# Altium project TIDA-01592-E1.PrjPcb (part 3 of 4)

## Sheet TIDA-01592_Power Supply2.SchDoc: Power Supply
size 431 x 279 mm; Date: Not shown in title block; ApprovedBy: Not shown in title block; CheckedBy: Not shown in title block; Author: Not shown in title block; CompanyName: Not shown in title block; DrawnBy: Abhishek Vishwa; Engineer: Abhishek Vishwa; Organization: Not shown in title block; Address1: Not shown in title block; Address2: Not shown in title block; Address3: Not shown in title block; Address4: Not shown in title block; DocumentNumber: 1; Revision: Use project parameter SCH_Rev; SheetNumber: 3; SheetTotal: 5; PageSetup: Record=PageOptions|CenterHorizontal=True|CenterVertical=True|PrintScale=1.00|XCorrection=1.00|YCorrection=1.00|PrintKind=0|BorderSize=5000000|LeftOffset=0|BottomOffset=0|Orientation=2|PaperLength=1000|PaperWidth=1000|Scale=100|PaperSource=15|PrintQuality=600|MediaType=1|DitherType=10|PaperKind=Letter|PrintScaleMode=1; CurrentTime: Not shown in title block; CurrentDate: Not shown in title block; Time: Not shown in title block; DocumentFullPathAndName: Not shown in title block; DocumentName: Not shown in title block; ModifiedDate: Not shown in title block; ImagePath: Not shown in title block; ProjectName: HV PS for Transmitter
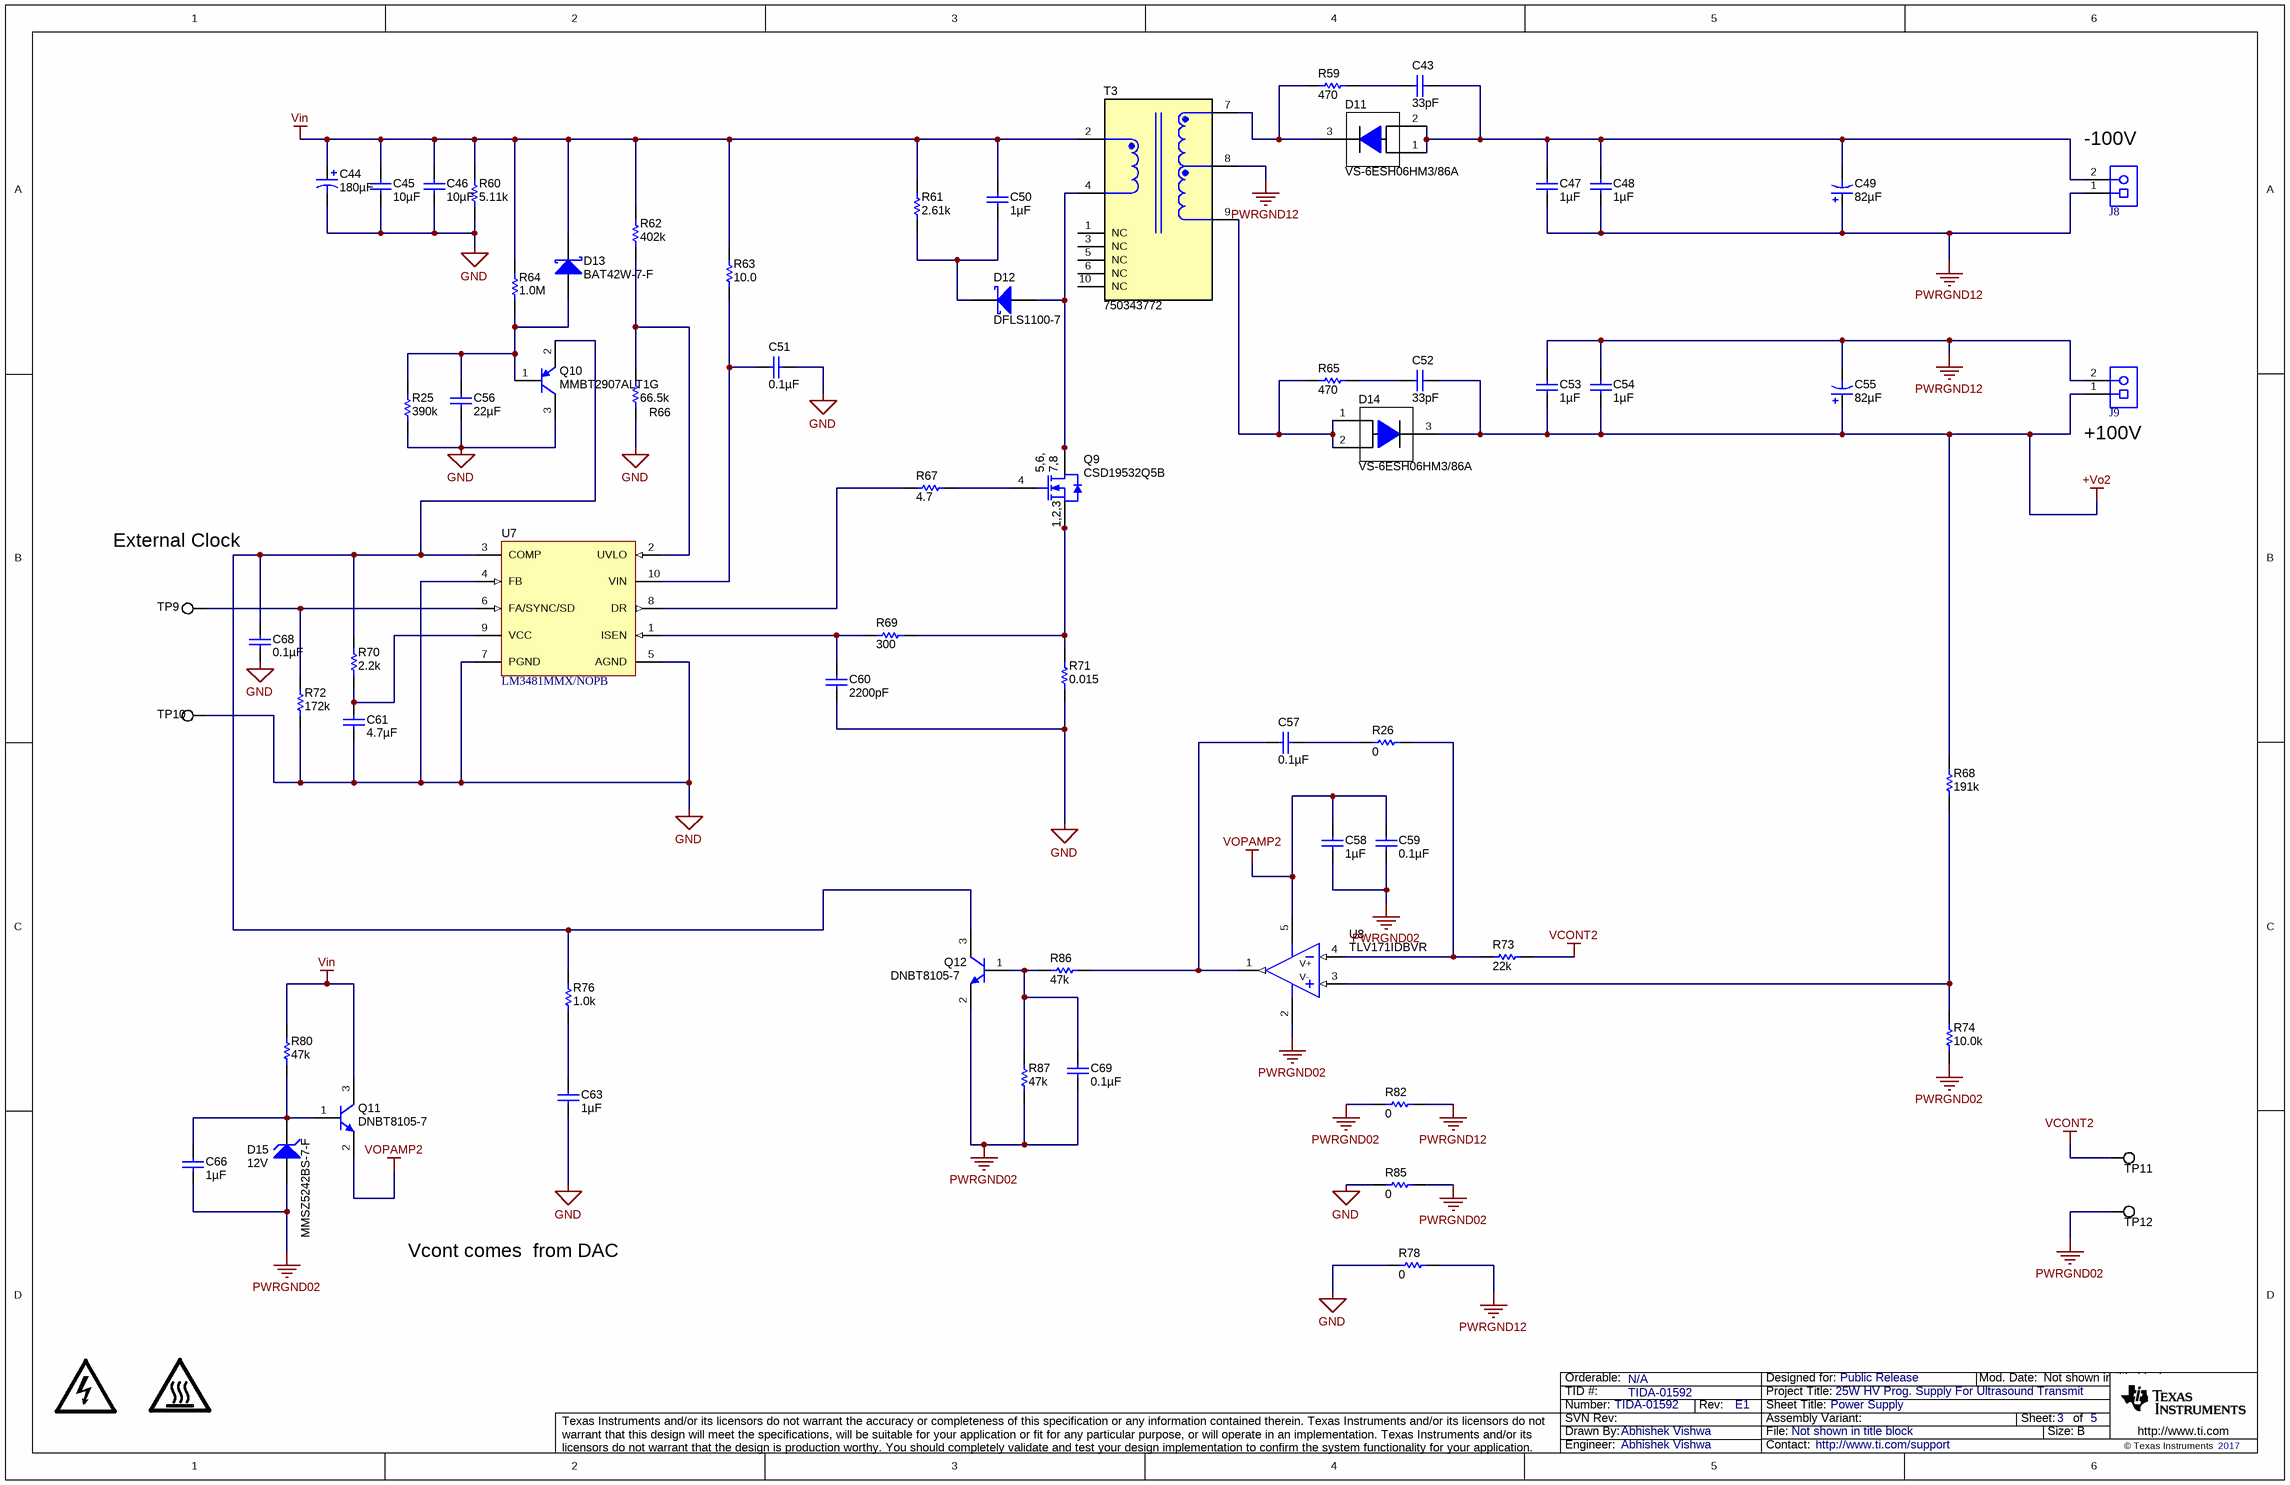
[diagram p2: TIDA-01592_Power Supply2.SchDoc]

### Parts
(Parts that share a designator on the sheet are numbered #1, #2 ... from top to bottom, then left to right.)
C43  ValueDisplayed: 33pF  [1206]  (hidden comment: 12067A330JAT2A)
C44  ValueDisplayed: 180µF  [FC_630x1120]  (hidden comment: 35TXW180MEFC6.3X25)
C45  ValueDisplayed: 10µF  [1206_180]  (hidden comment: GRM31CR61H106KA12L)
C46  ValueDisplayed: 10µF  [1206_180]  (hidden comment: GRM31CR61H106KA12L)
C47  ValueDisplayed: 1µF  [1812_180]  (hidden comment: C4532X7T2E105M250KE)
C48  ValueDisplayed: 1µF  [1812_180]  (hidden comment: C4532X7T2E105M250KE)
C49  ValueDisplayed: 82µF  [NHG_1000x2000]  (hidden comment: UCY2C820MPD9)
C50  ValueDisplayed: 1µF  [1206_180]  (hidden comment: GRM31CR72A105KA01L)
C51  ValueDisplayed: 0.1µF  [0603]  (hidden comment: GRM188R71H104KA93D)
C52  ValueDisplayed: 33pF  [1206]  (hidden comment: 12067A330JAT2A)
C53  ValueDisplayed: 1µF  [1812_180]  (hidden comment: C4532X7T2E105M250KE)
C54  ValueDisplayed: 1µF  [1812_180]  (hidden comment: C4532X7T2E105M250KE)
C55  ValueDisplayed: 82µF  [NHG_1000x2000]  (hidden comment: UCY2C820MPD9)
C56  ValueDisplayed: 22µF  [0805_HV1]  (hidden comment: C2012X5R1V226M125AC)
C57  ValueDisplayed: 0.1µF  [0603]  (hidden comment: GRM188R71H104KA93D)
C58  ValueDisplayed: 1µF  [0603]  (hidden comment: UMK107AB7105KA-T)
C59  ValueDisplayed: 0.1µF  [0603]  (hidden comment: GRM188R71H104KA93D)
C60  ValueDisplayed: 2200pF  [0402]  (hidden comment: GRM155R61H222KA01D)
C61  ValueDisplayed: 4.7µF  [0603]  (hidden comment: 0603ZD475KAT2A)
C63  ValueDisplayed: 1µF  [0603]  (hidden comment: C0603C105K3RACTU)
C66  ValueDisplayed: 1µF  [0603]  (hidden comment: C0603C105K3RACTU)
C68  ValueDisplayed: 0.1µF  [0603]  (hidden comment: GRM188R71H104KA93D)
C69  ValueDisplayed: 0.1µF  [0603]  (hidden comment: GRM188R71H104KA93D)
D11  VS-6ESH06HM3/86A  [TO-277A]
D12  DFLS1100-7  [PowerDI123]
D13  BAT42W-7-F  [SOD-123]
D14  VS-6ESH06HM3/86A  [TO-277A]
D15  MMSZ5242BS-7-F  value 12V  [SOD-323]
J8  1727010  [PhoenixConact_1727010]  (value not drawn)
J9  1727010  [PhoenixConact_1727010]  (value not drawn)
LOGO2#3  CAUTION HOT SURFACE  [IEC_HotSurface_Small]  (value not drawn)  (graphical)
LOGO8#3  DANGER HIGH VOLTAGE  [IEC_HighVoltage_Small]  (value not drawn)  (graphical)
Q9  CSD19532Q5B  [DNK0008A]
Q10  MMBT2907ALT1G  [SOT-23]
Q11  DNBT8105-7  [SOT-23]
Q12  DNBT8105-7  [SOT-23]
R25  ValueDisplayed: 390k  [0603]  (hidden comment: CRCW0603390KJNEA)
R26  ValueDisplayed: 0  [0402]  (hidden comment: CRCW04020000Z0ED)
R59  ValueDisplayed: 470  [1206]  (hidden comment: CRCW1206470RJNEA)
R60  ValueDisplayed: 5.11k  [TNPW0603]  (hidden comment: TNPW06035K11BEEA)
R61  ValueDisplayed: 2.61k  [2010]  (hidden comment: CRCW20102K61FKEF)
R62  ValueDisplayed: 402k  [0603]  (hidden comment: CRCW0603402KFKEA)
R63  R4: 10.0  [0603]  (hidden comment: CRCW060310R0FKEAHP)
R64  ValueDisplayed: 1.0M  [0603]  (hidden comment: CRCW06031M00JNEA)
R65  ValueDisplayed: 470  [1206]  (hidden comment: CRCW1206470RJNEA)
R66  ValueDisplayed: 66.5k  [0603]  (hidden comment: CRCW060366K5FKEA)
R67  ValueDisplayed: 4.7  [0603]  (hidden comment: CRCW06034R70JNEA)
R68  ValueDisplayed: 191k  [0603]  (hidden comment: CRCW0603191KFKEA)
R69  ValueDisplayed: 300  [0603]  (hidden comment: CRCW0603300RJNEA)
R70  ValueDisplayed: 2.2k  [0603]  (hidden comment: ERJ-3GEYJ222V)
R71  ValueDisplayed: 0.015  [2010]  (hidden comment: WSL2010R0150FEA18)
R72  ValueDisplayed: 172k  [0603]  (hidden comment: RT0603DRE07172KL)
R73  ValueDisplayed: 22k  [0603]  (hidden comment: CRCW060322K0JNEA)
R74  ValueDisplayed: 10.0k  [0603]  (hidden comment: CRCW060310K0FKEA)
R76  ValueDisplayed: 1.0k  [0603]  (hidden comment: CRCW06031K00JNEA)
R78  ValueDisplayed: 0  [2010L]  (hidden comment: CRCW20100000Z0EF)
R80  ValueDisplayed: 47k  [1206]  (hidden comment: CRCW120647K0JNEA)
R82  ValueDisplayed: 0  [2010L]  (hidden comment: CRCW20100000Z0EF)
R85  ValueDisplayed: 0  [2010L]  (hidden comment: CRCW20100000Z0EF)
R86  ValueDisplayed: 47k  [0603]  (hidden comment: RC0603JR-0747KL)
R87  ValueDisplayed: 47k  [0603]  (hidden comment: RC0603JR-0747KL)
T3  750343772  [Wurth_EE16_7_5_5278]
TP9  5002  [Keystone5002]  (value not drawn)
TP10  5002  [Keystone5002]  (value not drawn)
TP11  5002  [Keystone5002]  (value not drawn)
TP12  5002  [Keystone5002]  (value not drawn)
U7  LM3481MMX/NOPB  [MUB10A_N]
U8  TLV171IDBVR  [DBV0005A_N]

### Nets
+Vo2: C52.1 C53.2 C54.2 C55.1(+) D14.3(K) J9.1 R68.2
GND: C44.2(-) C45.2 C46.2 C51.1 C56.2 C60.2 C61.2 C63.2 C68.1 Q10.3(C) R25.1 R60.1 R66.1 R71.1 R72.1 R78.1 R85.1 TP10.1 U7.4(FB) U7.5(AGND) U7.7(PGND)
PWRGND02: C58.2 C59.2 C66.2 C69.1 D15.2(A) Q12.2(E) R74.2 R82.1 R85.2 R87.2 TP12.1 U8.2(V-)
PWRGND12: C47.2 C48.2 C49.1(+) C53.1 C54.1 C55.2(-) J8.1 J9.2 R78.2 R82.2 T3.8
VCONT2: R73.2 TP11.1
Vin: C44.1(+) C45.1 C46.1 C50.1 D13.1(K) Q11.3(C) R60.2 R61.2 R62.2 R63.1 R64.2 R80.2 T3.2
VOPAMP2: C58.1 C59.1 Q11.2(E) U8.5(V+)
NetC43_1: C43.1 C47.1 C48.1 C49.2(-) D11.1(A) D11.2(A) J8.2
NetC43_2: C43.2 R59.2
NetC50_2: C50.2 D12.1(K) R61.1
NetC51_2: C51.2 R63.2 U7.10(VIN)
NetC52_2: C52.2 R65.2
NetC56_1: C56.1 D13.2(A) Q10.1(B) R25.2 R64.1
NetC57_1: C57.1 R86.1 U8.1(OUT)
NetC57_2: C57.2 R26.1
NetC60_1: C60.1 R69.1 U7.1(ISEN)
NetC61_1: C61.1 R70.2 U7.9(VCC)
NetC63_1: C63.1 R76.1
NetC66_1: C66.1 D15.1(K) Q11.1(B) R80.1
NetC68_2: C68.2 Q10.2(E) Q12.3(C) R70.1 R76.2 U7.3(COMP)
NetC69_2: C69.2 Q12.1(B) R86.2 R87.1
NetD11_3: D11.3(K) R59.1 T3.7
NetD12_2: D12.2(A) Q9.5(D) Q9.6(D) Q9.7(D) Q9.8(D) Q9.9(D) T3.4
NetD14_1: D14.1(A) D14.2(A) R65.1 T3.9
NetQ9_1: Q9.1(S) Q9.2(S) Q9.3(S) R69.2 R71.2
NetQ9_4: Q9.4(G) R67.2
NetR26_2: R26.2 R73.1 U8.4(IN-)
NetR62_1: R62.1 R66.2 U7.2(UVLO)
NetR67_1: R67.1 U7.8(DR)
NetR68_1: R68.1 R74.1 U8.3(IN+)
NetR72_2: R72.2 TP9.1 U7.6(FA/SYNC/SD)

Not connected (* = marked no-connect by the designer): T3 1(NC) 3(NC) 5(NC) 6(NC) 10(NC)

### Notes on the sheet
- (near J8) -100V
- (near J9) +100V
- External Clock Synchronization
- Vcont comes  from DAC
- Drawn By:
- SVN Rev:
- Number:
- TID #:
- Orderable:
- Rev:
- Sheet Title:
- File:
- Project Title:
- Designed for:
- Assembly Variant:
- Mod. Date:
- Sheet:
- Size:
- of
- B
- http://www.ti.com
- Texas Instruments and/or its licensors do not warrant the accuracy or completeness of this specification or any information contained therein. Texas Instruments and/or its licensors do not warrant that this design will meet the specifications, will be suitable for your application or fit for any particular purpose, or will operate in an implementation. Texas Instruments and/or its licensors do not warrant that the design is production worthy. You should completely validate and test your design implementation to confirm the system functionality for your application.
- Engineer:
- Contact:
- © Texas Instruments
- (in symbol CSD19532Q5B) 5,6,; 7,8; 1,2,3

### Library data of the parts
C43 C52 = 12067A330JAT2A: CAP, CERM, 33 pF, 500 V,+/- 5%, C0G/NP0, 1206; Manufacturer: AVX; Polarized: N; CompType: Capacitor; Value: 33pF; U/M: EA; Cap_F: 0.000000000033; Tolerance_%: 5; VDC_V: 500; Value2: 500V; TaMin_C: -55; TaMax_C: 125; SizeArea_mm2: 5.12; SizeAreaWB_mm2: 10.92; SizeX_mm: 3.2; SizeY_mm: 1.6; SizeZ_mm: 1.35; AEC Category: Q200; Green_Lifecycle: Not Set; Green_REACh: Incomplete; SymbolVersion: 2008-07-09; PartNumber: 12067A330JAT2A; PackageReference: 1206; RoHS: Y; MountType: SMT; Technology: Ceramic; TempCo: C0G/NP0; Cap_Case: 1206; Published: 2008-06-19; Publisher: Texas Instruments; LatestRevisionDate: 2017-06-22; ComponentLink1Description: Datasheet link; ComponentLink1URL: http://partbuilder.avx.com/p/pb/pdf/1027/C0GNP0-Dielectric.pdf; Supplier 1: Digi-Key; Supplier Part Number 1: 12067A330JAT2A-ND; Supplier 2: Newark; Supplier Part Number 2: 55J9805; Supplier 3: Mouser; Supplier Part Number 3: 581-12067A330JAT2A; AEC Qualified: N; AEC Grade: N/A; Green_EU RoHS: Incomplete; Green_EU RoHS-2: Incomplete
C44 = EEU-FC1V470: CAP, AL, 180 µF, 35 V, +/- 20%, TH; Manufacturer: Rubycon; Polarized: Y; CompType: Capacitor; Value: 180uF; U/M: EA; Cap_F: 0.000180; Tolerance_%: 20; VDC_V: 35; Value2: 35V; IRMS_A: 0.29; TaMin_C: -55; TaMax_C: 105; Cap_Case: 6.3x11.2mm; SizeAreaWB_mm2: 68.89; SizeArea_mm2: 39.69; SizeX_mm: 6.3; SizeZ_mm: 12.2; AEC Category: Q200; AEC Grade: 2; SymbolVersion: 2008-07-09; PartNumber: 35TXW180MEFC6.3X25; RoHS: Y; MountType: TH; Technology: AL; Series: FC; SizeY_mm: 6.3; Publisher: Texas Instruments; LatestRevisionDate: 2017-06-22; Supplier 1: Digi-Key; Supplier Part Number 1: 35TXW180MEFC6.3X25-ND; AEC Qualified: Y
C45 C46 = GRM31CR61H106KA12L: CAP, CERM, 10 µF, 50 V,+/- 10%, X5R, 1206; Manufacturer: MuRata; Polarized: N; CompType: Capacitor; Value: 10uF; U/M: EA; Cap_F: 0.00001; Tolerance_%: 10; VDC_V: 50; Value2: 50V; TaMin_C: -55; TaMax_C: 85; Cap_Case: 1206; SizeArea_mm2: 5.12; SizeAreaWB_mm2: 10.92; SizeX_mm: 3.2; SizeY_mm: 1.6; SizeZ_mm: 1.8; AEC Category: Q200; Green_Lifecycle: Active; Green_REACh: Passed; SymbolVersion: 2008-07-09; PartNumber: GRM31CR61H106KA12L; PackageReference: 1206; RoHS: Y; MountType: SMT; Technology: Ceramic; TempCo: X5R; Published: 2008-06-19; Publisher: Texas Instruments; LatestRevisionDate: 2017-06-22; ComponentLink1Description: Datasheet link; ComponentLink1URL: http://search.murata.co.jp/Ceramy/image/img/A01X/G101/ENG/GRM31CR61H106KA12-01.pdf; Supplier 1: Digi-Key; Supplier Part Number 1: 490-5961-1-ND; Supplier 2: Newark; Supplier Part Number 2: 13T1214; Supplier 3: Mouser; Supplier Part Number 3: 81-GRM31CR61H106KA2L; AEC Qualified: N; AEC Grade: N/A; Green_EU RoHS: Passed; Green_EU RoHS-2: Incomplete
C47 C48 C53 C54 = C4532X7R1H105K160KA: CAP, CERM, 1 µF, 250 V,+/- 20%, X7T, 1812; Manufacturer: TDK Corporation; Polarized: N; CompType: Capacitor; Value: 1uF; U/M: EA; Cap_F: 0.000001; Tolerance_%: 20; ESR_ohm: 0.007217; Value1: 0.007217 ohm; VDC_V: 50; Value2: 250V; IRMS_A: 2.85919; TaMin_C: -55; TaMax_C: 125; Cap_Case: 1812; SizeArea_mm2: 14.4; SizeAreaWB_mm2: 23.1; SizeX_mm: 4.5; SizeY_mm: 3.2; SizeZ_mm: 1.8; AEC Category: Q200; SymbolVersion: 2008-07-09; PartNumber: C4532X7T2E105M250KE; PackageReference: 1812; RoHS: Y; MountType: SMT; Technology: Ceramic; TempCo: X7T; Published: 2008-06-19; Publisher: Texas Instruments; LatestRevisionDate: 2017-06-22; ComponentLink1Description: Datasheet link; ComponentLink1URL: https://product.tdk.com/en/search/capacitor/ceramic/mlcc/info?part_no=C4532X7R1H105K160KA; Supplier 1: Digi-Key; Supplier Part Number 1: 445-6835-2-ND; Supplier 2: Mouser; Supplier Part Number 2: C4532X7T2E105M250KE; AEC Qualified: N; AEC Grade: N/A
C49 C55 = ECA-2AHG101: CAP, AL, 82 µF, 160 V, +/- 20%, TH; Manufacturer: Nichicon; Polarized: Y; CompType: Capacitor; Value: 82uF; U/M: EA; Cap_F: 0.0001; Tolerance_%: 20; VDC_V: 160; Value2: 160V; IRMS_A: 0.265; TaMin_C: -55; TaMax_C: 105; Cap_Case: 10x20mm; SizeAreaWB_mm2: 144; SizeArea_mm2: 100; SizeX_mm: 10; SizeZ_mm: 22; AEC Category: Q200; Green_Lifecycle: Active; Green_REACh: Passed; SymbolVersion: 2008-07-09; PartNumber: UCY2C820MPD9; PackageReference: 10x20mm; RoHS: Y; MountType: TH; Technology: AL; Series: NHG; SizeY_mm: 10; Publisher: Texas Instruments; LatestRevisionDate: 2017-06-22; Supplier 1: Digi-Key; Supplier Part Number 1: 493-6989-ND; AEC Qualified: ?; Green_EU RoHS: Passed; Green_EU RoHS-2: Passed
C50 = GRM31CR72A105KA01L: CAP, CERM, 1 µF, 100 V,+/- 10%, X7R, 1206; Manufacturer: MuRata; Polarized: N; CompType: Capacitor; Value: 1uF; U/M: EA; Cap_F: 0.000001; Tolerance_%: 10; VDC_V: 100; Value2: 100V; TaMin_C: -55; TaMax_C: 125; Cap_Case: 1206; SizeArea_mm2: 5.12; SizeAreaWB_mm2: 10.92; SizeX_mm: 3.2; SizeY_mm: 1.6; SizeZ_mm: 1.8; AEC Category: Q200; Green_Lifecycle: Active; Green_REACh: Passed; SymbolVersion: 2008-07-09; PartNumber: GRM31CR72A105KA01L; PackageReference: 1206; RoHS: Y; MountType: SMT; Technology: Ceramic; TempCo: X7R; Published: 2008-06-19; Publisher: Texas Instruments; LatestRevisionDate: 2017-06-22; ComponentLink1Description: Datasheet link; ComponentLink1URL: http://search.murata.co.jp/Ceramy/PnsearchViewAction.do?HnOFG=ON&HnNFG=ON&SEL_CNT=50&sLang=en&sKey=GRM31CR72A105KA01L&x=9&y=9&search=startwith; Supplier 1: Digi-Key; Supplier Part Number 1: 490-3909-1-ND; Supplier 2: Mouser; Supplier Part Number 2: 81-GRM31CR72A105KA01; Supplier 3: Farnell; Supplier Part Number 3: 1735543; AEC Qualified: ?; Green_EU RoHS: Passed; Green_EU RoHS-2: Incomplete
C51 C57 C59 C68 C69 = GRM188R71H104KA93D: CAP, CERM, 0.1 µF, 50 V,+/- 10%, X7R, 0603; Manufacturer: MuRata; Polarized: N; CompType: Capacitor; Value: 0.1uF; U/M: EA; Cap_F: 0.0000001; Tolerance_%: 10; VDC_V: 50; Value2: 50V; TaMin_C: -55; TaMax_C: 125; SizeArea_mm2: 1.28; SizeAreaWB_mm2: 4.68; SizeX_mm: 1.6; SizeY_mm: 0.8; SizeZ_mm: 1; AEC Category: Q200; Green_Lifecycle: Active; Green_REACh: Passed; SymbolVersion: 2008-07-09; PartNumber: GRM188R71H104KA93D; PackageReference: 0603; RoHS: Y; MountType: SMT; Technology: Ceramic; TempCo: X7R; Cap_Case: 0603; Published: 2008-06-19; Publisher: Texas Instruments; LatestRevisionDate: 2017-06-22; ComponentLink1Description: Datasheet link; ComponentLink1URL: http://search.murata.co.jp/Ceramy/PnsearchViewAction.do?HnOFG=ON&HnNFG=ON&SEL_CNT=50&sLang=en&sKey=GRM188R71H104KA93D&x=9&y=9&search=startwith; Supplier 1: Digi-Key; Supplier Part Number 1: 490-1519-1-ND; Supplier 2: Mouser; Supplier Part Number 2: 81-GRM39X104K50D; Supplier 3: Farnell; Supplier Part Number 3: 8820023; AEC Qualified: ?; Green_EU RoHS: Passed; Green_EU RoHS-2: Incomplete
C56 = GRM21BC81C226ME44L: CAP, CERM, 22 µF, 35 V,+/- 20%, X5R, 0805; Manufacturer: TDK Corporation; Polarized: N; CompType: Capacitor; Value: 22uF; U/M: EA; Cap_F: 0.000022; Tolerance_%: 20; VDC_V: 16; Value2: 35V; TempCo: X6S; TaMin_C: -55; TaMax_C: 105; Cap_Case: 0805; SizeArea_mm2: 2.5; SizeAreaWB_mm2: 6.75; SizeX_mm: 2; SizeY_mm: 1.25; SizeZ_mm: 1.45; AEC Category: Q200; SymbolVersion: 2008-07-09; PartNumber: C2012X5R1V226M125AC; PackageReference: 0805; RoHS: Y; MountType: SMT; Technology: Ceramic; Published: 2008-06-19; Publisher: Texas Instruments; LatestRevisionDate: 2017-06-22; ComponentLink1Description: Datasheet link; ComponentLink1URL: http://psearch.en.murata.com/capacitor/product/GRM21BC81C226ME44%23.pdf; Supplier 1: Digi-Key; Supplier Part Number 1: 445-14428-2-ND; Supplier 2: Newark; Supplier Part Number 2: C2012X5R1V226M125AC; Supplier 3: Mouser; Supplier Part Number 3: C2012X5R1V226M125AC; AEC Qualified: N; AEC Grade: N/A
C58 = UMK107AB7105KA-T: CAP, CERM, 1 µF, 50 V,+/- 10%, X7R, 0603; Manufacturer: Taiyo Yuden; Polarized: N; CompType: Capacitor; Value: 1uF; U/M: EA; Cap_F: 0.000001; Tolerance_%: 10; VDC_V: 50; Value2: 50V; TaMin_C: -55; TaMax_C: 125; SizeArea_mm2: 1.28; SizeAreaWB_mm2: 4.68; SizeX_mm: 1.6; SizeY_mm: 0.8; SizeZ_mm: 1; AEC Category: Q200; Green_Lifecycle: Active; Green_REACh: Passed; SymbolVersion: 2008-07-09; PartNumber: UMK107AB7105KA-T; PackageReference: 0603; RoHS: Y; MountType: SMT; Technology: Ceramic; TempCo: X7R; Cap_Case: 0603; Published: 2008-06-19; Publisher: Texas Instruments; LatestRevisionDate: 2017-06-22; ComponentLink1Description: Datasheet link; ComponentLink1URL: http://www.yuden.co.jp/ut/product/category/capacitor/UMK107AB7105KA-T.pdf; Supplier 1: Digi-Key; Supplier Part Number 1: 587-3247-1-ND; Supplier 2: Newark; Supplier Part Number 2: 45W1781; Supplier 3: Mouser; Supplier Part Number 3: 963-UMK107AB7105KA-T; AEC Qualified: ?; Green_EU RoHS: Passed; Green_EU RoHS-2: Passed
C60 = GRM155R61H222KA01D: CAP, CERM, 2200 pF, 50 V,+/- 10%, X5R, 0402; Manufacturer: MuRata; Polarized: N; CompType: Capacitor; Value: 2200pF; U/M: EA; Cap_F: 0.0000000022; Tolerance_%: 10; VDC_V: 50; Value2: 50V; TaMin_C: -55; TaMax_C: 85; SizeArea_mm2: 0.5; SizeAreaWB_mm2: 3; SizeX_mm: 1; SizeZ_mm: 0.6; AEC Category: Q200; Green_Lifecycle: Active; Green_REACh: Passed; SymbolVersion: 2008-07-09; PartNumber: GRM155R61H222KA01D; PackageReference: 0402; RoHS: Y; MountType: SMT; Technology: Ceramic; TempCo: X5R; Cap_Case: 0402; SizeY_mm: 0.5; Published: 2008-06-19; Publisher: Texas Instruments; LatestRevisionDate: 2017-06-22; ComponentLink1Description: Datasheet link; ComponentLink1URL: http://search.murata.co.jp/Ceramy/PnsearchViewAction.do?HnOFG=ON&HnNFG=ON&SEL_CNT=50&sLang=en&sKey=GRM155R61H222KA01D&x=9&y=9&search=startwith; Supplier 1: Digi-Key; Supplier Part Number 1: GRM155R61H222KA01D-ND; Supplier 2: Mouser; Supplier Part Number 2: 81-GRM155R61H222KA1D; AEC Qualified: ?; Green_EU RoHS: Passed; Green_EU RoHS-2: Incomplete
C61 = 0603ZD475KAT2A: CAP, CERM, 4.7 µF, 10 V,+/- 10%, X5R, 0603; Manufacturer: AVX; Polarized: N; CompType: Capacitor; Value: 4.7uF; U/M: EA; Cap_F: 0.0000047; Tolerance_%: 10; Value2: 10V; TaMin_C: -55; TaMax_C: 85; SizeArea_mm2: 1.28; SizeAreaWB_mm2: 4.68; SizeX_mm: 1.6; SizeY_mm: 0.8; SizeZ_mm: 1; AEC Category: Q200; Green_Lifecycle: Active; Green_REACh: Passed; SymbolVersion: 2008-07-09; PartNumber: 0603ZD475KAT2A; PackageReference: 0603; RoHS: Y; VDC_V: 10; MountType: SMT; Technology: Ceramic; TempCo: X5R; Cap_Case: 0603; Published: 2008-06-19; Publisher: Texas Instruments; LatestRevisionDate: 2017-06-22; ComponentLink1Description: Datasheet link; ComponentLink1URL: http://datasheets.avx.com/cx5r.pdf; Supplier 1: Digi-Key; Supplier Part Number 1: 478-7943-1-ND; Supplier 2: Newark; Supplier Part Number 2: 85R5666; Supplier 3: Mouser; Supplier Part Number 3: 581-0603ZD475KAT2A; AEC Qualified: N; AEC Grade: N/A; Green_EU RoHS: Passed; Green_EU RoHS-2: Incomplete
C63 C66 = C0603C105K3RACTU: CAP, CERM, 1 µF, 25 V,+/- 10%, X7R, 0603; Manufacturer: Kemet; Polarized: N; CompType: Capacitor; Value: 1uF; U/M: EA; Cap_F: 0.000001; Tolerance_%: 10; VDC_V: 25; Value2: 25V; TaMin_C: -55; TaMax_C: 125; SizeArea_mm2: 1.28; SizeAreaWB_mm2: 4.68; SizeX_mm: 1.6; SizeY_mm: 0.8; SizeZ_mm: 1; AEC Category: Q200; Green_Lifecycle: Active; Green_REACh: Passed; SymbolVersion: 2008-07-09; PartNumber: C0603C105K3RACTU; PackageReference: 0603; RoHS: Y; MountType: SMT; Technology: Ceramic; TempCo: X7R; Cap_Case: 0603; Published: 2008-06-19; Publisher: Texas Instruments; LatestRevisionDate: 2017-06-22; ComponentLink1Description: Datasheet link; ComponentLink1URL: http://capacitoredge.kemet.com/capedge2/DataSheet/Datasheet-C0603C105K3RACTU.pdf?pn=C0603C105K3RACTU; Supplier 1: Digi-Key; Supplier Part Number 1: 399-7376-1-ND; Supplier 2: Newark; Supplier Part Number 2: 24W4858; Supplier 3: Mouser; Supplier Part Number 3: 80-C0603C105K3R; AEC Qualified: ?; Green_EU RoHS: Passed; Green_EU RoHS-2: Passed
D11 D14 = VS-6ESH06HM3/86A: Diode, Hyperfast, 600 V, 6 A, AEC-Q101, TO-277A; Manufacturer: Vishay-Semiconductor; SymbolCreator: a0412235; U/M: EA; Vf_V: 1.05; Value: 600V; Value1: 6A; Value2: 1.05V; Io_A: 6; Vr_V: 600; TJmax_C: 175; RJC_CperW: 3.5; SizeAreaWB_mm2: 57.375; SizeArea_mm2: 30.875; SizeX_mm: 6.5; SizeY_mm: 4.75; SizeZ_mm: 1.2; AEC Category: Q101; AEC Qualified: Y; SymbolVersion: 2013-01-13; PartNumber: VS-6ESH06HM3/86A; PackageReference: TO-277A; CompType: Diode; MountType: SMT; Type: Hyperfast; RoHS: Y; Published: 2008-06-26; Publisher: Texas Instruments; LatestRevisionDate: 2017-06-26; ComponentLink1Description: Datasheet link; ComponentLink1URL: http://www.vishay.com/docs/94985/vs-6esh06hm3.pdf; Supplier 1: Digi-Key; Supplier Part Number 1: VS-6ESH06HM3/86AGICT-ND; Supplier 2: Newark; Supplier Part Number 2: 45Y8966; Supplier 3: Mouser; Supplier Part Number 3: 78-VS-6ESH06HM3/86A
D12 = DFLS1100-7: Diode, Schottky, 100 V, 1 A, PowerDI123; Manufacturer: Diodes Inc.; U/M: EA; Vf_V: 0.77; Value: 100V; Value1: 1A; Value2: 0.77V; Io_A: 1; Vr_V: 100; TJmax_C: 175; RJC_CperW: 7; SizeAreaWB_mm2: 13.066; SizeArea_mm2: 6.586; SizeX_mm: 3.7; SizeY_mm: 1.78; SizeZ_mm: 0.98; AEC Category: Q101; Green_Lifecycle: Active; Green_REACh: Passed; CompType: Diode; SymbolVersion: 2008-12-08; PartNumber: DFLS1100-7; PackageReference: PowerDI123; MountType: SMT; Type: Schottky; RoHS: Y; Published: 2008-06-26; Publisher: Texas Instruments; LatestRevisionDate: 2017-06-26; ComponentLink1Description: Datasheet link; ComponentLink1URL: http://www.diodes.com/datasheets/ds30497.pdf; Supplier 1: Digi-Key; Supplier Part Number 1: DFLS1100DICT-ND; Supplier 2: Mouser; Supplier Part Number 2: 621-DFLS1100-7; Supplier 3: Farnell; Supplier Part Number 3: 1713889; AEC Qualified: ?; Green_EU RoHS: Passed with Exemption; Green_EU RoHS-2: Passed
D13 = BAT42W-7-F: Diode, Schottky, 30 V, 0.2 A, SOD-123; Manufacturer: Diodes Inc.; U/M: EA; Vf_V: 1; Value: 30V; Value1: 0.2A; Value2: 1V; Io_A: 0.2; Vr_V: 30; SizeAreaWB_mm2: 13.095; SizeArea_mm2: 6.545; SizeX_mm: 3.85; SizeY_mm: 1.7; SizeZ_mm: 1.35; AEC Category: Q101; Green_Lifecycle: Not Set; Green_REACh: Incomplete; CompType: Diode; SymbolVersion: 2008-12-08; PartNumber: BAT42W-7-F; PackageReference: SOD-123; MountType: SMT; Type: Schottky; RoHS: Y; Published: 2008-06-26; Publisher: Texas Instruments; LatestRevisionDate: 2017-06-26; ComponentLink1Description: Datasheet link; ComponentLink1URL: http://www.diodes.com/datasheets/ds30016.pdf; Supplier 1: Digi-Key; Supplier Part Number 1: BAT42WDICT-ND; Supplier 2: Mouser; Supplier Part Number 2: 621-BAT42W-F; Supplier 3: Farnell; Supplier Part Number 3: 1843718; AEC Qualified: ?; Green_EU RoHS: Incomplete; Green_EU RoHS-2: Incomplete
D15 = MMSZ5242BS-7-F: Diode, Zener, 12 V, 200 mW, SOD-323; Manufacturer: Diodes Inc.; SymbolCreator: a0412235; U/M: EA; Power_W: 0.2; Vz_V: 12; Value1: 0.2W; RJA_CperW: 350; SizeAreaWB_mm2: 8.695; SizeArea_mm2: 3.645; SizeX_mm: 2.7; SizeY_mm: 1.35; SizeZ_mm: 1; AEC Category: Q101; SymbolVersion: 2010-08-25; PartNumber: MMSZ5242BS-7-F; PackageReference: SOD-323; CompType: Zener; Vr_V: N/A; MountType: SMT; RoHS: Y; ComponentLink1Description: Datasheet link; ComponentLink1URL: http://www.diodes.com/datasheets/ds31038.pdf; Published: 2008-10-08; Publisher: Texas Instruments; LatestRevisionDate: 2017-06-20; LatestRevisionNote: Updated Supplier Data; Supplier 1: Digi-Key; Supplier Part Number 1: MMSZ5242BS-FDICT-ND; Supplier 2: Mouser; Supplier Part Number 2: 621-MMSZ5242BS-F; AEC Qualified: ?
J8 J9 = 1727010: Conn Term Block, 2POS, 3.81mm, TH; Manufacturer: Phoenix Contact; SymbolCreator: a0412235; CompType: Terminal Block; SymbolVersion: 2013-09-04; PartNumber: 1727010; PackageReference: 2POS Terminal Block; RoHS: Y; MountType: TH; ComponentLink1Description: Datasheet URL; ComponentLink1URL: http://eshop.phoenixcontact.com/phoenix/pdf.do?UID=1727010&general=usen; Publisher: Texas Instruments; LatestRevisionDate: 2017-01-19; Supplier 1: Digi-Key; Supplier Part Number 1: 277-1947-ND
LOGO2#3 = IEC_HotSurface: IEC 61010-1 Hot Surface Warning; SymbolCreator: a0412235; SymbolVersion: 2011-08-22; Published: 2009-03-03; Publisher: Texas Instruments; LatestRevisionDate: 2016-03-21
LOGO8#3 = IEC_HighVoltage: IEC 61010-1 High Voltage Warning; SymbolCreator: a0412235; SymbolVersion: 2011-08-22; Published: 2009-03-03; Publisher: Texas Instruments; LatestRevisionDate: 2016-03-21
Q9 = CSD19532Q5B: MOSFET, N-CH, 100 V, 17 A, DNK0008A (VSON-CLIP-8); Manufacturer: Texas Instruments; Alternate Manufacturer: None; U/M: EA; ChType: N; Value: 100V; VdsMax_V: 100; Value1: ? ohm; Value2: 48 nC; QgTyp_nC: 48; Vgs_V: 20; IdsMax_A: 17; SizeAreaWB_mm2: 56; SizeArea_mm2: 30; SizeX_mm: 6; SizeY_mm: 5; SizeZ_mm: 1; AEC Category: Q101; SymbolVersion: 2011-08-16; PartNumber: CSD19532Q5B; PackageReference: DNK0008A; CompType: MOSFET; RoHS: Y; MountType: SMT; Published: 2008-06-19; Publisher: Texas Instruments; LatestRevisionDate: 2017-06-26; LatestRevisionNote: Added parts.; ComponentLink1Description: Datasheet link; ComponentLink1URL: http://www.ti.com/lit/ds/symlink/csd19532q5b.pdf; Supplier 1: Digi-Key; Supplier Part Number 1: 296-37478-6-ND; Supplier 2: Farnell; Supplier Part Number 2: 2413268; AEC Qualified: N
Q10 = MMBT2907ALT1G, ON Semiconductor: Transistor, PNP, 60 V, 0.6 A, SOT-23; CompType: BJT; PNP: 1; NPN: 0; Vceo_V: 60; Vcesat1_V: 1.6; Value: 60 V; IcRated_A: 0.6; Value1: 0.6 A; TaMin_C: -55; TaMax_C: 150; SizeAreaWB_mm2: 14; SizeArea_mm2: 7.5; SizeX_mm: 2.5; SizeY_mm: 3; SizeZ_mm: 1.1; U/M: EA; AEC Category: Q101; Green_Lifecycle: Active; Green_REACh: Passed; SymbolVersion: 2008-07-31; PartNumber: MMBT2907ALT1G; Manufacturer: ON Semiconductor; PackageReference: SOT-23; RoHS: Y; Published: 2008-07-31; LatestRevisionDate: 2017-06-09; Publisher: Texas Instruments; ComponentLink1Description: Datasheet link; ComponentLink1URL: http://www.onsemi.com/pub_link/Collateral/MMBT2907ALT1-D.PDF; Supplier 1: Digi-Key; Supplier Part Number 1: MMBT2907ALT1GOSCT-ND; Supplier 2: Newark; Supplier Part Number 2: 88H4785; Supplier 3: Mouser; Supplier Part Number 3: 863-MMBT2907ALT1G; MountType: SMT; AEC Qualified: ?; Green_EU RoHS: Passed; Green_EU RoHS-2: Passed
Q11 Q12 = DNBT8105-7, Diodes Inc.: Transistor, NPN, 60 V, 1 A, AEC-Q101, SOT-23; CompType: BJT; PNP: 0; NPN: 1; Vceo_V: 60; Vcesat1_V: 0.25; Value: 60 V; Value1: 1 A; HfeMax: 300; TaMin_C: -55; TaMax_C: 150; SizeAreaWB_mm2: 14; SizeArea_mm2: 7.5; SizeX_mm: 2.5; SizeY_mm: 3; SizeZ_mm: 1.1; U/M: EA; AEC Category: Q101; AEC Qualified: Y; Green_Lifecycle: Not Set; Green_REACh: Incomplete; SymbolVersion: 2008-07-31; PartNumber: DNBT8105-7; Manufacturer: Diodes Inc.; PackageReference: SOT-23; RoHS: Y; IcRated_A: 1; Value2: 300; Published: 2008-07-31; LatestRevisionDate: 2017-06-09; Publisher: Texas Instruments; ComponentLink1Description: Datasheet link; ComponentLink1URL: https://www.diodes.com/assets/Datasheets/ds30513.pdf; Supplier 1: Digi-Key; Supplier Part Number 1: DNBT8105DICT-ND; Supplier 2: Newark; Supplier Part Number 2: 25R4543; Supplier 3: Mouser; Supplier Part Number 3: 621-DNBT8105-7; MountType: SMT; Green_EU RoHS: Incomplete; Green_EU RoHS-2: Incomplete
R25 = CRCW0603390KJNEA: RES, 390 k, 5%, 0.1 W, 0603; Manufacturer: Vishay-Dale; CompType: Resistor; Value: 390k; Res_ohm: 390000; Tolerance_%: 5; Power_W: 0.1; Value2: 0.1W; VDC_V: 75; TempCo: 200 ppm/C; SizeArea_mm2: 1.28; SizeX_mm: 1.6; SizeY_mm: 0.8; SizeZ_mm: 1; EIA_Code: E24; U/M: EA; AEC Category: Q200; SymbolVersion: 2009-05-29; PartNumber: CRCW0603390KJNEA; PackageReference: 0603; RoHS: Y; Value_Code: 390k; Value1: 5%; MountType: SMT; Technology: Thick Film; Published: 2008-06-26; Publisher: Texas Instruments; LatestRevisionDate: 2017-06-13; ComponentLink1Description: Datasheet link; ComponentLink1URL: http://www.vishay.com/docs/20035/dcrcwe3.pdf; Supplier 1: Digi-Key; Supplier Part Number 1: 541-390KGCT-ND; AEC Qualified: ?
R26 = CRCW04020000Z0ED: RES, 0, 5%, 0.063 W, 0402; Manufacturer: Vishay-Dale; CompType: Resistor; Value: 0; Value_Code: 0000; Tolerance_%: 5; Power_W: 0.063; Value2: 0.063W; VDC_V: 50; TempCo: 200 ppm/C; SizeArea_mm2: 0.5; SizeX_mm: 1; SizeZ_mm: 0.6; EIA_Code: E24; U/M: EA; AEC Category: Q200; Green_Lifecycle: Active; Green_REACh: Passed; SymbolVersion: 2009-05-29; PartNumber: CRCW04020000Z0ED; PackageReference: 0402; RoHS: Y; Res_ohm: 0; Value1: 5%; MountType: SMT; Technology: Thick Film; SizeY_mm: 0.5; Published: 2008-06-26; Publisher: Texas Instruments; LatestRevisionDate: 2017-06-12; ComponentLink1Description: Datasheet link; ComponentLink1URL: http://www.vishay.com/docs/20035/dcrcwe3.pdf; Supplier 1: Digi-Key; Supplier Part Number 1: 541-0.0JCT-ND; Supplier 2: Newark; Supplier Part Number 2: 52K6543; Supplier 3: Mouser; Supplier Part Number 3: 71-CRCW0402-0-E3; AEC Qualified: ?; Green_EU RoHS: Passed with Exemption; Green_EU RoHS-2: Passed
R59 R65 = CRCW1206470RJNEA: RES, 470, 5%, 0.25 W, 1206; Manufacturer: Vishay-Dale; CompType: Resistor; Value: 470; Value_Code: 470R; Tolerance_%: 5; Power_W: 0.25; Value2: 0.25W; VDC_V: 200; TempCo: 200 ppm/C; SizeArea_mm2: 5.12; SizeX_mm: 3.2; SizeY_mm: 1.6; SizeZ_mm: 1.35; EIA_Code: E24; U/M: EA; AEC Category: Q200; SymbolVersion: 2009-05-29; PartNumber: CRCW1206470RJNEA; PackageReference: 1206; RoHS: Y; Res_ohm: 470; Value1: 5%; MountType: SMT; Technology: Thick Film; Published: 2008-06-26; Publisher: Texas Instruments; LatestRevisionDate: 2017-06-12; ComponentLink1Description: Datasheet link; ComponentLink1URL: http://www.vishay.com/docs/20035/dcrcwe3.pdf; Supplier 1: Digi-Key; Supplier Part Number 1: 541-470ECT-ND; Supplier 2: Newark; Supplier Part Number 2: 59M6998; Supplier 3: Mouser; Supplier Part Number 3: 71-CRCW1206J-470-E3; AEC Qualified: ?
R60 = TNPW06035K11BEEA: RES, 5.11 k, 0.1%, 0.1 W, AEC-Q200 Grade 1, 0603; Manufacturer: Vishay-Dale; CompType: Resistor; Value: 5.11k; Res_ohm: 5110; Value_Code: 5k11; Tolerance_%: 0.1; Value2: 0.1W; VDC_V: 75; TempCo: 25 ppm/C; SizeArea_mm2: 1.36; SizeX_mm: 1.6; SizeY_mm: 0.85; SizeZ_mm: 0.55; EIA_Code: E192; U/M: EA; AEC Category: Q200; AEC Qualified: Y; AEC Grade: 1; SymbolVersion: 2009-05-29; PartNumber: TNPW06035K11BEEA; PackageReference: 0603; RoHS: Y; Value1: 0.1%; Power_W: 0.1; MountType: SMT; Technology: Thin Film; Published: 2008-06-26; Publisher: Texas Instruments; LatestRevisionDate: 2017-06-13; ComponentLink1Description: Datasheet link; ComponentLink1URL: http://www.vishay.com/docs/28758/tnpw_e3.pdf; Supplier 1: Digi-Key; Supplier Part Number 1: TNP5.11KAACT-ND; Supplier 2: Newark; Supplier Part Number 2: 05R3817; Supplier 3: Mouser; Supplier Part Number 3: 71-TNPW06035K11BEEA
R61 = CRCW20102K61FKEF: RES, 2.61 k, 1%, 0.75 W, AEC-Q200 Grade 0, 2010; Manufacturer: Vishay-Dale; CompType: Resistor; Value: 2.61k; Res_ohm: 2610; Value_Code: 2k61; Tolerance_%: 1; Power_W: 0.75; Value2: 0.75W; VDC_V: 400; TempCo: 100 ppm/C; SizeArea_mm2: 12.5; SizeX_mm: 5; SizeY_mm: 2.5; SizeZ_mm: 1.66; EIA_Code: E96; U/M: EA; AEC Category: Q200; AEC Qualified: Y; AEC Grade: 0; SymbolVersion: 2009-05-29; PartNumber: CRCW20102K61FKEF; PackageReference: 2010; RoHS: Y; Value1: 1%; MountType: SMT; Technology: Thick Film; Published: 2008-06-26; Publisher: Texas Instruments; LatestRevisionDate: 2017-04-20; ComponentLink1Description: Datasheet link; ComponentLink1URL: http://www.vishay.com/doc?20035; Supplier 1: Digi-Key; Supplier Part Number 1: 541-2.61KACCT-ND
R62 = CRCW0603402KFKEA: RES, 402 k, 1%, 0.1 W, 0603; Manufacturer: Vishay-Dale; CompType: Resistor; Value: 402k; Res_ohm: 402000; Tolerance_%: 1; Power_W: 0.1; Value2: 0.1W; VDC_V: 75; TempCo: 100 ppm/C; SizeArea_mm2: 1.28; SizeX_mm: 1.6; SizeY_mm: 0.8; EIA_Code: E96; U/M: EA; AEC Category: Q200; Green_Lifecycle: Active; Green_REACh: Passed; SymbolVersion: 2009-05-29; PartNumber: CRCW0603402KFKEA; PackageReference: 0603; RoHS: Y; Value_Code: 402k; Value1: 1%; MountType: SMT; Technology: Thick Film; SizeZ_mm: 1; Published: 2008-06-26; Publisher: Texas Instruments; LatestRevisionDate: 2017-06-13; ComponentLink1Description: Datasheet link; ComponentLink1URL: http://www.vishay.com/docs/20035/dcrcwe3.pdf; Supplier 1: Digi-Key; Supplier Part Number 1: 541-402KHCT-ND; Supplier 2: Newark; Supplier Part Number 2: 52K8511; Supplier 3: Mouser; Supplier Part Number 3: 71-CRCW0603-402K-E3; AEC Qualified: ?; Green_EU RoHS: Passed with Exemption; Green_EU RoHS-2: Passed
R63 = CRCW060310R0FKEAHP: RES, 10.0, 1%, 0.25 W, 0603; Manufacturer: Vishay-Dale; CompType: Resistor; Value: 10.0; Res_ohm: 10; Value_Code: 10R0; Tolerance_%: 1; Power_W: 0.25; Value2: 0.25W; VDC_V: 75; TempCo: 100 ppm/C; SizeArea_mm2: 1.28; SizeX_mm: 1.6; SizeY_mm: 0.8; EIA_Code: E96; U/M: EA; AEC Category: Q200; Green_Lifecycle: Active; Green_REACh: Passed; SymbolVersion: 2009-05-29; PartNumber: CRCW060310R0FKEAHP; PackageReference: 0603; RoHS: Y; Value1: 1%; MountType: SMT; Technology: Thick Film; SizeZ_mm: 1; Published: 2008-06-26; Publisher: Texas Instruments; LatestRevisionDate: 2017-06-13; ComponentLink1Description: Datasheet link; ComponentLink1URL: http://www.vishay.com/docs/20043/crcwhpe3.pdf; Supplier 1: Digi-Key; Supplier Part Number 1: 541-10.0SCT-ND; Supplier 2: Newark; Supplier Part Number 2: 24T7073; Supplier 3: Mouser; Supplier Part Number 3: 71-CRCW060310R0FKEAH; AEC Qualified: ?; Green_EU RoHS: Passed with Exemption; Green_EU RoHS-2: Passed
R64 = CRCW06031M00JNEA: RES, 1.0 M, 5%, 0.1 W, 0603; Manufacturer: Vishay-Dale; CompType: Resistor; Value: 1.0Meg; Res_ohm: 1000000; Value_Code: 1M00; Tolerance_%: 5; Power_W: 0.1; Value2: 0.1W; VDC_V: 75; TempCo: 200 ppm/C; SizeArea_mm2: 1.28; SizeX_mm: 1.6; SizeY_mm: 0.8; SizeZ_mm: 1; EIA_Code: E24; U/M: EA; AEC Category: Q200; Green_Lifecycle: Active; Green_REACh: Passed; SymbolVersion: 2009-05-29; PartNumber: CRCW06031M00JNEA; PackageReference: 0603; RoHS: Y; Value1: 5%; MountType: SMT; Technology: Thick Film; Published: 2008-06-26; Publisher: Texas Instruments; LatestRevisionDate: 2017-06-13; ComponentLink1Description: Datasheet link; ComponentLink1URL: http://www.vishay.com/docs/20035/dcrcwe3.pdf; Supplier 1: Digi-Key; Supplier Part Number 1: 541-1.0MGCT-ND; Supplier 2: Newark; Supplier Part Number 2: 59M6756; Supplier 3: Mouser; Supplier Part Number 3: 71-CRCW0603J-1.0M-E3; AEC Qualified: ?; Green_EU RoHS: Passed with Exemption; Green_EU RoHS-2: Passed
R66 = CRCW060366K5FKEA: RES, 66.5 k, 1%, 0.1 W, 0603; Manufacturer: Vishay-Dale; CompType: Resistor; Value: 66.5k; Res_ohm: 66500; Value_Code: 66k5; Tolerance_%: 1; Power_W: 0.1; Value2: 0.1W; VDC_V: 75; TempCo: 100 ppm/C; SizeArea_mm2: 1.28; SizeX_mm: 1.6; SizeY_mm: 0.8; EIA_Code: E96; U/M: EA; AEC Category: Q200; Green_Lifecycle: Active; Green_REACh: Passed; SymbolVersion: 2009-05-29; PartNumber: CRCW060366K5FKEA; PackageReference: 0603; RoHS: Y; Value1: 1%; MountType: SMT; Technology: Thick Film; SizeZ_mm: 1; Published: 2008-06-26; Publisher: Texas Instruments; LatestRevisionDate: 2017-06-13; ComponentLink1Description: Datasheet link; ComponentLink1URL: http://www.vishay.com/docs/20035/dcrcwe3.pdf; Supplier 1: Digi-Key; Supplier Part Number 1: 541-66.5KHCT-ND; Supplier 2: Newark; Supplier Part Number 2: 52K8670; Supplier 3: Mouser; Supplier Part Number 3: 71-CRCW0603-66.5K-E3; AEC Qualified: ?; Green_EU RoHS: Passed with Exemption; Green_EU RoHS-2: Passed
R67 = CRCW06034R70JNEA: RES, 4.7, 5%, 0.1 W, 0603; Manufacturer: Vishay-Dale; CompType: Resistor; Value: 4.7; Value_Code: 4R70; Tolerance_%: 5; Power_W: 0.1; Value2: 0.1W; VDC_V: 75; TempCo: 200 ppm/C; SizeArea_mm2: 1.28; SizeX_mm: 1.6; SizeY_mm: 0.8; SizeZ_mm: 1; EIA_Code: E24; U/M: EA; AEC Category: Q200; Green_Lifecycle: Active; Green_REACh: Passed; SymbolVersion: 2009-05-29; PartNumber: CRCW06034R70JNEA; PackageReference: 0603; RoHS: Y; Res_ohm: 4.7; Value1: 5%; MountType: SMT; Technology: Thick Film; Published: 2008-06-26; Publisher: Texas Instruments; LatestRevisionDate: 2017-06-13; ComponentLink1Description: Datasheet link; ComponentLink1URL: http://www.vishay.com/docs/20035/dcrcwe3.pdf; Supplier 1: Digi-Key; Supplier Part Number 1: 541-4.7GCT-ND; Supplier 2: Newark; Supplier Part Number 2: 59M6813; Supplier 3: Mouser; Supplier Part Number 3: 71-CRCW0603J-4.7-E3; AEC Qualified: ?; Green_EU RoHS: Passed with Exemption; Green_EU RoHS-2: Passed
R68 = CRCW0603191KFKEA: RES, 191 k, 1%, 0.1 W, 0603; Manufacturer: Vishay-Dale; CompType: Resistor; Value: 191k; Res_ohm: 191000; Tolerance_%: 1; Power_W: 0.1; Value2: 0.1W; VDC_V: 75; TempCo: 100 ppm/C; SizeArea_mm2: 1.28; SizeX_mm: 1.6; SizeY_mm: 0.8; EIA_Code: E96; U/M: EA; AEC Category: Q200; Green_Lifecycle: Active; Green_REACh: Passed; SymbolVersion: 2009-05-29; PartNumber: CRCW0603191KFKEA; PackageReference: 0603; RoHS: Y; Value_Code: 191k; Value1: 1%; MountType: SMT; Technology: Thick Film; SizeZ_mm: 1; Published: 2008-06-26; Publisher: Texas Instruments; LatestRevisionDate: 2017-06-13; ComponentLink1Description: Datasheet link; ComponentLink1URL: http://www.vishay.com/docs/20035/dcrcwe3.pdf; Supplier 1: Digi-Key; Supplier Part Number 1: 541-191KHCT-ND; Supplier 2: Newark; Supplier Part Number 2: 52K8218; Supplier 3: Mouser; Supplier Part Number 3: 71-CRCW0603-191K-E3; AEC Qualified: ?; Green_EU RoHS: Passed with Exemption; Green_EU RoHS-2: Passed
R69 = CRCW0603300RJNEA: RES, 300, 5%, 0.1 W, 0603; Manufacturer: Vishay-Dale; CompType: Resistor; Value: 300; Value_Code: 300R; Tolerance_%: 5; Power_W: 0.1; Value2: 0.1W; VDC_V: 75; TempCo: 200 ppm/C; SizeArea_mm2: 1.28; SizeX_mm: 1.6; SizeY_mm: 0.8; SizeZ_mm: 1; EIA_Code: E24; U/M: EA; AEC Category: Q200; Green_Lifecycle: Active; Green_REACh: Passed; SymbolVersion: 2009-05-29; PartNumber: CRCW0603300RJNEA; PackageReference: 0603; RoHS: Y; Res_ohm: 300; Value1: 5%; MountType: SMT; Technology: Thick Film; Published: 2008-06-26; Publisher: Texas Instruments; LatestRevisionDate: 2017-06-13; ComponentLink1Description: Datasheet link; ComponentLink1URL: http://www.vishay.com/docs/20035/dcrcwe3.pdf; Supplier 1: Digi-Key; Supplier Part Number 1: 541-300GCT-ND; Supplier 2: Newark; Supplier Part Number 2: 59M6801; Supplier 3: Mouser; Supplier Part Number 3: 71-CRCW0603J-300-E3; AEC Qualified: ?; Green_EU RoHS: Passed with Exemption; Green_EU RoHS-2: Passed
R70 = ERJ-3GEYJ222V: RES, 2.2 k, 5%, 0.1 W, AEC-Q200 Grade 0, 0603; Manufacturer: Panasonic; CompType: Resistor; Value: 2.2k; Res_ohm: 2200; Value_Code: 2k20; Tolerance_%: 5; Power_W: 0.1; Value2: 0.1W; VDC_V: 75; TempCo: 200 ppm/C; SizeArea_mm2: 1.28; SizeX_mm: 1.6; SizeY_mm: 0.8; SizeZ_mm: 1; EIA_Code: E24; U/M: EA; AEC Category: Q200; AEC Qualified: Y; AEC Grade: 0; Green_Lifecycle: Active; Green_REACh: Passed; SymbolVersion: 2009-05-29; PartNumber: ERJ-3GEYJ222V; PackageReference: 0603; RoHS: Y; Value1: 5%; MountType: SMT; Technology: Thick Film; Published: 2008-06-26; Publisher: Texas Instruments; LatestRevisionDate: 2017-06-13; ComponentLink1Description: Datasheet link; ComponentLink1URL: https://industrial.panasonic.com/cdbs/www-data/pdf/RDA0000/AOA0000C281.pdf; Supplier 1: Digi-Key; Supplier Part Number 1: P2.2KGCT-ND; Supplier 2: Newark; Supplier Part Number 2: 65T8604; Supplier 3: Mouser; Supplier Part Number 3: 667-ERJ-3GEYJ222V; Green_EU RoHS: Passed with Exemption; Green_EU RoHS-2: Passed
R71 = WSL2010R0150FEA18: RES, 0.015, 1%, 1 W, 2010; Manufacturer: Vishay-Dale; CompType: Resistor; Value: 0.015; Value_Code: R015; Tolerance_%: 1; Value2: 1W; TempCo: 75 ppm/C; SizeArea_mm2: 12.5; SizeX_mm: 5; SizeY_mm: 2.5; SizeZ_mm: 1.66; EIA_Code: E96; U/M: EA; AEC Category: Q200; SymbolVersion: 2009-05-29; PartNumber: WSL2010R0150FEA18; PackageReference: 2010; RoHS: Y; Res_ohm: 0.015; Value1: 1%; Power_W: 1; MountType: SMT; Technology: Metal Film; Published: 2008-06-26; Publisher: Texas Instruments; LatestRevisionDate: 2017-04-20; ComponentLink1Description: Datasheet link; ComponentLink1URL: http://www.vishay.com/docs/31057/wslhigh.pdf; Supplier 1: Digi-Key; Supplier Part Number 1: WSLF-.015CT-ND; Supplier 2: Mouser; Supplier Part Number 2: 71-WSL2010R0150FEA18; Supplier 3: Farnell; Supplier Part Number 3: 1107365; AEC Qualified: ?
R72 = RT0603DRE07172KL: RES, 172 k, 0.5%, 0.1 W, 0603; Manufacturer: Yageo America; CompType: Resistor; Value: 172k; Res_ohm: 172000; Tolerance_%: 0.5; Power_W: 0.1; Value2: 0.1W; VDC_V: 75; TempCo: 50 ppm/C; SizeArea_mm2: 1.28; SizeX_mm: 1.6; SizeY_mm: 0.8; SizeZ_mm: 1; EIA_Code: E192; U/M: EA; AEC Category: Q200; SymbolVersion: 2009-05-29; PartNumber: RT0603DRE07172KL; PackageReference: 0603; RoHS: Y; Value_Code: 172k; Value1: 0.5%; MountType: SMT; Technology: Thin Film; Published: 2008-06-26; Publisher: Texas Instruments; LatestRevisionDate: 2017-06-13; ComponentLink1Description: Datasheet link; ComponentLink1URL: http://www.yageo.com/pdf/PYu-RT_1-to-0.05_RoHS_L_3.pdf; AEC Qualified: ?
R73 = CRCW060322K0JNEA: RES, 22 k, 5%, 0.1 W, 0603; Manufacturer: Vishay-Dale; CompType: Resistor; Value: 22k; Res_ohm: 22000; Value_Code: 22k0; Tolerance_%: 5; Power_W: 0.1; Value2: 0.1W; VDC_V: 75; TempCo: 200 ppm/C; SizeArea_mm2: 1.28; SizeX_mm: 1.6; SizeY_mm: 0.8; SizeZ_mm: 1; EIA_Code: E24; U/M: EA; AEC Category: Q200; Green_Lifecycle: Active; Green_REACh: Passed; SymbolVersion: 2009-05-29; PartNumber: CRCW060322K0JNEA; PackageReference: 0603; RoHS: Y; Value1: 5%; MountType: SMT; Technology: Thick Film; Published: 2008-06-26; Publisher: Texas Instruments; LatestRevisionDate: 2017-06-13; ComponentLink1Description: Datasheet link; ComponentLink1URL: http://www.vishay.com/docs/20035/dcrcwe3.pdf; Supplier 1: Digi-Key; Supplier Part Number 1: 541-22KGCT-ND; Supplier 2: Newark; Supplier Part Number 2: 59M6786; Supplier 3: Mouser; Supplier Part Number 3: 71-CRCW0603J-22K-E3; AEC Qualified: ?; Green_EU RoHS: Passed with Exemption; Green_EU RoHS-2: Passed
R74 = CRCW060310K0FKEA: RES, 10.0 k, 1%, 0.1 W, 0603; Manufacturer: Vishay-Dale; CompType: Resistor; Value: 10.0k; Res_ohm: 10000; Value_Code: 10k0; Tolerance_%: 1; Power_W: 0.1; Value2: 0.1W; VDC_V: 75; TempCo: 100 ppm/C; SizeArea_mm2: 1.28; SizeX_mm: 1.6; SizeY_mm: 0.8; EIA_Code: E96; U/M: EA; AEC Category: Q200; Green_Lifecycle: Active; Green_REACh: Passed; SymbolVersion: 2009-05-29; PartNumber: CRCW060310K0FKEA; PackageReference: 0603; RoHS: Y; Value1: 1%; MountType: SMT; Technology: Thick Film; SizeZ_mm: 1; Published: 2008-06-26; Publisher: Texas Instruments; LatestRevisionDate: 2017-06-13; ComponentLink1Description: Datasheet link; ComponentLink1URL: http://www.vishay.com/docs/20035/dcrcwe3.pdf; Supplier 1: Digi-Key; Supplier Part Number 1: 541-10.0KHCT-ND; Supplier 2: Newark; Supplier Part Number 2: 52K8062; Supplier 3: Mouser; Supplier Part Number 3: 71-CRCW0603-10K-E3; AEC Qualified: ?; Green_EU RoHS: Passed with Exemption; Green_EU RoHS-2: Passed
R76 = CRCW06031K00JNEA: RES, 1.0 k, 5%, 0.1 W, 0603; Manufacturer: Vishay-Dale; CompType: Resistor; Value: 1.0k; Res_ohm: 1000; Value_Code: 1k00; Tolerance_%: 5; Power_W: 0.1; Value2: 0.1W; VDC_V: 75; TempCo: 200 ppm/C; SizeArea_mm2: 1.28; SizeX_mm: 1.6; SizeY_mm: 0.8; SizeZ_mm: 1; EIA_Code: E24; U/M: EA; AEC Category: Q200; Green_Lifecycle: Active; Green_REACh: Passed; SymbolVersion: 2009-05-29; PartNumber: CRCW06031K00JNEA; PackageReference: 0603; RoHS: Y; Value1: 5%; MountType: SMT; Technology: Thick Film; Published: 2008-06-26; Publisher: Texas Instruments; LatestRevisionDate: 2017-06-13; ComponentLink1Description: Datasheet link; ComponentLink1URL: http://www.vishay.com/docs/20035/dcrcwe3.pdf; Supplier 1: Digi-Key; Supplier Part Number 1: 541-1.0KGCT-ND; Supplier 2: Newark; Supplier Part Number 2: 59M6750; Supplier 3: Mouser; Supplier Part Number 3: 71-CRCW0603J-1.0K-E3; AEC Qualified: ?; Green_EU RoHS: Passed with Exemption; Green_EU RoHS-2: Passed
R78 R82 R85 = CRCW20100000Z0EF: RES, 0, 5%, 0.75 W, AEC-Q200 Grade 0, 2010; Manufacturer: Vishay-Dale; CompType: Resistor; Value: 0; Value_Code: 0000; Tolerance_%: 5; Power_W: 0.75; Value2: 0.75W; TempCo: ppm/C; SizeArea_mm2: 12.5; SizeY_mm: 2.5; SizeZ_mm: 1.66; EIA_Code: E24; U/M: EA; AEC Category: Q200; AEC Qualified: Y; SymbolVersion: 2009-05-29; PartNumber: CRCW20100000Z0EF; PackageReference: 2010; RoHS: Y; Res_ohm: 0; Value1: 5%; MountType: SMT; Technology: Thick Film; SizeX_mm: 5; Published: 2008-06-26; Publisher: Texas Instruments; LatestRevisionDate: 2017-04-20; ComponentLink1Description: Datasheet link; ComponentLink1URL: http://www.vishay.com/doc?20035; Supplier 1: Digi-Key; Supplier Part Number 1: 541-0.0WCT-ND; AEC Grade: 0
R80 = CRCW120647K0JNEA: RES, 47 k, 5%, 0.25 W, 1206; Manufacturer: Vishay-Dale; CompType: Resistor; Value: 47k; Res_ohm: 47000; Value_Code: 47k0; Tolerance_%: 5; Power_W: 0.25; Value2: 0.25W; VDC_V: 200; TempCo: 200 ppm/C; SizeArea_mm2: 5.12; SizeX_mm: 3.2; SizeY_mm: 1.6; SizeZ_mm: 1.35; EIA_Code: E24; U/M: EA; AEC Category: Q200; SymbolVersion: 2009-05-29; PartNumber: CRCW120647K0JNEA; PackageReference: 1206; RoHS: Y; Value1: 5%; MountType: SMT; Technology: Thick Film; Published: 2008-06-26; Publisher: Texas Instruments; LatestRevisionDate: 2017-06-12; ComponentLink1Description: Datasheet link; ComponentLink1URL: http://www.vishay.com/docs/20035/dcrcwe3.pdf; Supplier 1: Digi-Key; Supplier Part Number 1: 541-47KECT-ND; Supplier 2: Newark; Supplier Part Number 2: 59M6996; Supplier 3: Mouser; Supplier Part Number 3: 71-CRCW1206J-47K-E3; AEC Qualified: ?
R86 R87 = RC0603JR-0747KL: RES, 47 k, 5%, 0.1 W, 0603; Manufacturer: Yageo America; CompType: Resistor; Value: 47k; Res_ohm: 47000; Value_Code: 47k0; Tolerance_%: 5; Power_W: 0.1; Value2: 0.1W; VDC_V: 50; TempCo: 100 ppm/C; SizeArea_mm2: 1.28; SizeX_mm: 1.6; SizeY_mm: 0.8; SizeZ_mm: 1; EIA_Code: E24; U/M: EA; AEC Category: Q200; Green_Lifecycle: Active; Green_REACh: Passed; SymbolVersion: 2009-05-29; PartNumber: RC0603JR-0747KL; PackageReference: 0603; RoHS: Y; Value1: 5%; MountType: SMT; Technology: Thick Film; Published: 2008-06-26; Publisher: Texas Instruments; LatestRevisionDate: 2017-06-13; ComponentLink1Description: Datasheet link; ComponentLink1URL: http://www.yageo.com/pdf/Pu-RC0603_51_PbFree_L_2.pdf; Supplier 1: Digi-Key; Supplier Part Number 1: 311-47KGRCT-ND; Supplier 2: Mouser; Supplier Part Number 2: 603-RC0603JR-0747KL; Supplier 3: Farnell; Supplier Part Number 3: 9233580; AEC Qualified: ?; Green_EU RoHS: Passed with Exemption; Green_EU RoHS-2: Passed
T3 = CMP-0081056-1: Transformer, 13 uH, TH; Manufacturer: Wurth Elektronik; LeakageInd_H: 300nH; Rsec2_ohm: 1.45; SizeAreaWB_mm2: 379.25; DCR_ohm: 0.022; Value: 13uH; Lp: 13; SizeZ_mm: 18.8; SizeX_mm: 16.5; SizeY_mm: 18.5; Ns1toNp: 5.5; SizeArea_mm2: 305.25; Ind_H: 13µH; AEC Qualified: N; Rsec1_ohm: 1; AEC Category: Q200; ComponentLink1URL: https://sps16.itg.ti.com/sites/KMS/crossdivteams/altium/docs/ComponentDatasheets/750343772,Rev00(For TI India, EE16, Two outputs, 20W).pdf; RoHS: Y; MountType: TH; PackageReference: 16.5x18.5mm; CompType: Transformer; Ns2toNp: 5.5; PartNumber: 750343772; ComponentLink1Description: Datasheet URL; AEC Grade: N/A; ValueDisplayed: 13µH
TP9-TP12 = 5002: Test Point, Miniature, White, TH; Manufacturer: Keystone; CompType: Test Point Loop; ContactFinish: Silver; SymbolVersion: 2008-04-04; PartNumber: 5002; PackageReference: White Miniature Testpoint; RoHS: Y; MountType: TH; ComponentLink1Description: Datasheet URL; ComponentLink1URL: http://www.keyelco.com/userAssets/file/M60-2p60.pdf; Color: White; Publisher: Texas Instruments; LatestRevisionDate: 2016-09-27; Supplier 1: Digi-Key; Supplier Part Number 1: 36-5002-ND; Supplier 2: Mouser; Supplier Part Number 2: 534-5002; Supplier 3: Newark; Supplier Part Number 3: 82H9632
U7 = LM3481MMX/NOPB: High Efficiency Low-Side N-Channel Controller for Switching Regulators, 10-pin MSOP, Pb-Free; Manufacturer: Texas Instruments; PackageTopMarking: ZXTT*SJPB; PowerWise: N; CompType: MiscPower; Published: 1-Mar-2010; DatasheetVersion: Nov-2007; PackageVersion: revB, Jul-2003; PackageReference: MUB10A; Publisher: Altium Limited; PackageDescription: Mini-SO, Molded, .118 x .118 x .034in Body, 10 Lead, .0197in Pitch; Supplier 1: Digi-Key; Supplier Part Number 1: LM3481MMX-ND; PartNumber: LM3481MMX/NOPB; RoHS: Y; PinCount: 10; Code_JEDEC: MO-187-BA; ComponentLink1Description: LM3481 Datasheet; ComponentLink1URL: http://www.national.com/ds/LM/LM3481.pdf; ComponentLink2Description: LM3481 Web Page; ComponentLink2URL: http://www.national.com/pf/LM/LM3481.html; ComponentLink3Description: MUB10A Package Page; ComponentLink3URL: http://www.national.com/packaging/folders/mub10a.html
U8 = TLV171IDBVR: 36V, Low-Power, RRO, General-Purpose Operational Amplifier, DBV0005A (SOT-23-5); Alternate PartNumber: TLV171IDBVT; Manufacturer: Texas Instruments; SizeArea_mm2: 8.12; SizeAreaWB_mm2: 14.82; SizeX_mm: 2.8; SizeY_mm: 2.9; SizeZ_mm: 1.45; CompType: IC; U/M: EA; SymbolVersion: 2008-11-25; PartNumber: TLV171IDBVR; PackageReference: DBV0005A; PackageDescription: SOT-23-5; MountType: SMT; ComponentLink1Description: Datasheet Link; ComponentLink1URL: http://www.ti.com/lit/ds/symlink/tlv171.pdf; RoHS: Y; Publisher: Texas Instruments; LatestRevisionDate: 2017-05-22; Alternate Manufacturer: Texas Instruments